# Altium schematic sheet Main_ascii.SchDoc
size 513 x 386 mm
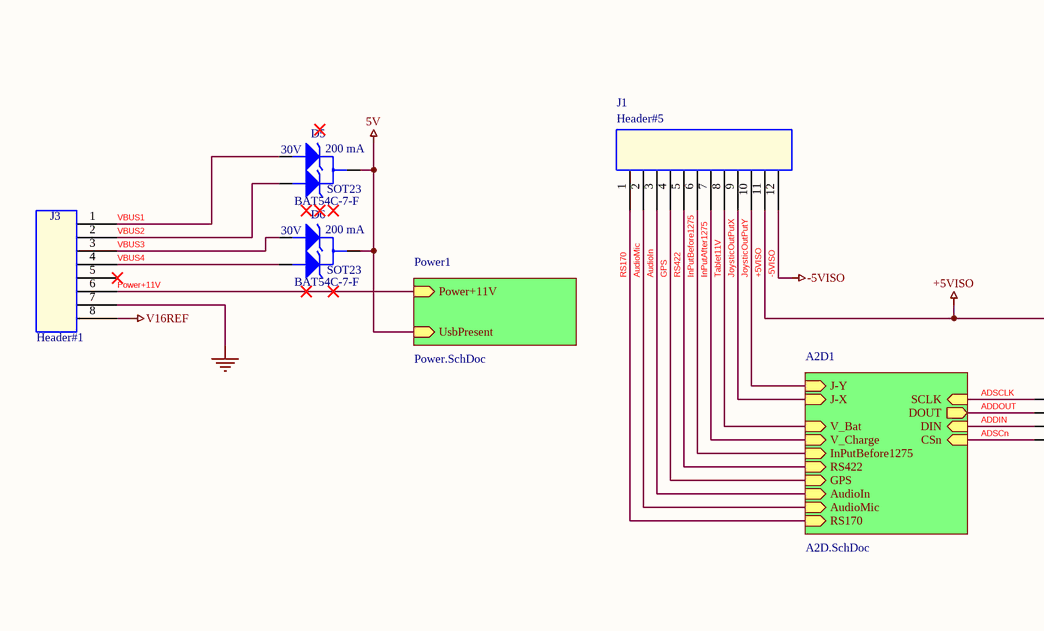
[diagram p0: Main_ascii.SchDoc, left]
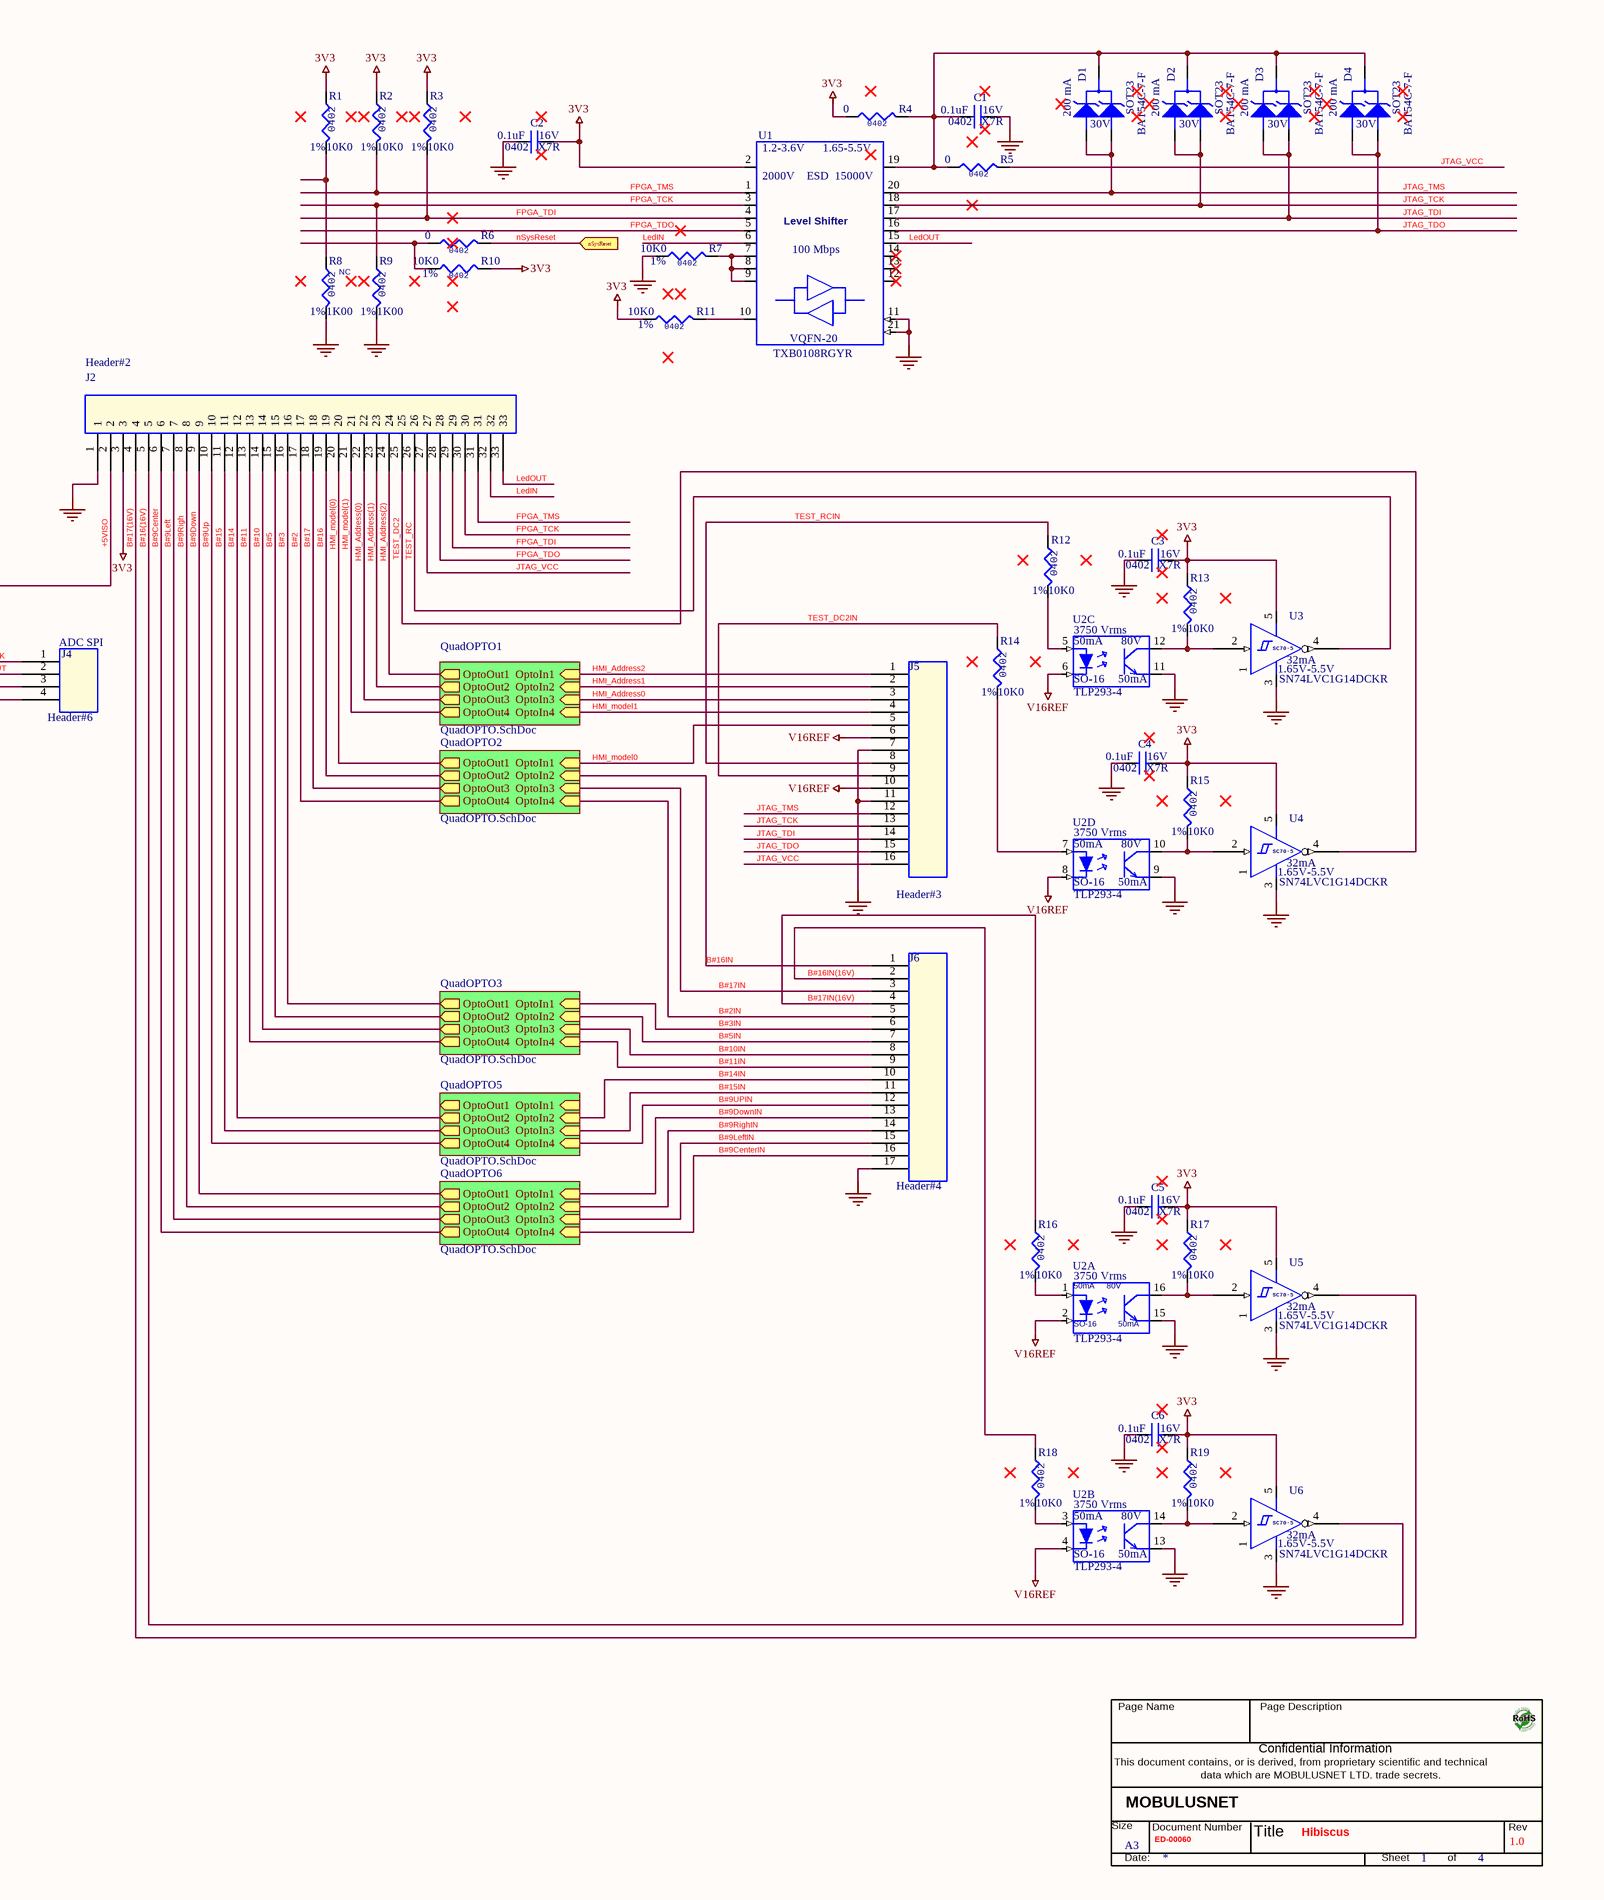
[diagram p1: Main_ascii.SchDoc, right]

## Parts
*  Title: Hibiscus  RevCode: 1.0  Page Size: A3  Page Number: 1  Page Count: 4  Doc: ED-00060  (hidden comment: MobulusTitleBlock)  (graphical)
C1  0.1uF  VOLTAGE: 16V  PCBFootPrint: 0402   X7R  [0402]
C2  0.1uF  VOLTAGE: 16V  PCBFootPrint: 0402   X7R  [0402]
C3  0.1uF  VOLTAGE: 16V  PCBFootPrint: 0402   X7R  [0402]
C4  0.1uF  VOLTAGE: 16V  PCBFootPrint: 0402   X7R  [0402]
C5  0.1uF  VOLTAGE: 16V  PCBFootPrint: 0402   X7R  [0402]
C6  0.1uF  VOLTAGE: 16V  PCBFootPrint: 0402   X7R  [0402]
D1  BAT54C-7-F  Current: 200 mA  VOLTAGE: 30V  FootPrint: SOT23  [SOT23_BAT54]
D2  BAT54C-7-F  Current: 200 mA  VOLTAGE: 30V  FootPrint: SOT23  [SOT23_BAT54]
D3  BAT54C-7-F  Current: 200 mA  VOLTAGE: 30V  FootPrint: SOT23  [SOT23_BAT54]
D4  BAT54C-7-F  Current: 200 mA  VOLTAGE: 30V  FootPrint: SOT23  [SOT23_BAT54]
D5  BAT54C-7-F  Current: 200 mA  VOLTAGE: 30V  FootPrint: SOT23  [SOT23_BAT54]
D6  BAT54C-7-F  Current: 200 mA  VOLTAGE: 30V  FootPrint: SOT23  [SOT23_BAT54]
J1  Header#5  [39-28-1123]
J2  Header#2  [501190-3027]
J3  Header#1  [B07B-XASK-1]
J4  Header#6  Label: ADC SPI  [B04B-XASK-1]
J5  Header#3  [501568-1507]
J6  Header#4  [501568-1507]
R1  10K0  Tolerance: 1%  [0402]
R2  10K0  Tolerance: 1%  [0402]
R3  10K0  Tolerance: 1%  [0402]
R4  0  [0402]
R5  0  [0402]
R6  0  [0402]
R7  10K0  Tolerance: 1%  [0402]
R8  1K00  Tolerance: 1%  ASSY: NC  [0402]
R9  1K00  Tolerance: 1%  [0402]
R10  10K0  Tolerance: 1%  [0402]
R11  10K0  Tolerance: 1%  [0402]
R12  10K0  Tolerance: 1%  [0402]
R13  10K0  Tolerance: 1%  [0402]
R14  10K0  Tolerance: 1%  [0402]
R15  10K0  Tolerance: 1%  [0402]
R16  10K0  Tolerance: 1%  [0402]
R17  10K0  Tolerance: 1%  [0402]
R18  10K0  Tolerance: 1%  [0402]
R19  10K0  Tolerance: 1%  [0402]
U1  TXB0108RGYR  Data rate: 100 Mbps  Voltage: 1.2-3.6V      1.65-5.5V  PcbFootprint: VQFN-20  ESD: 2000V    ESD  15000V  [VQFN-20_TXB0108]
U2  TLP293-4  Power: 50mA      80V  ISO: 3750 Vrms  FootPrint: SO-16  Current Power: 50mA  [SO-16_TLP293-4]  (parts A,B,C,D of 4)
U3  SN74LVC1G14DCKR  VOLTAGE: 1.65V-5.5V  Current: 32mA  [SC70-5_SN74LVC1G14DCKR]
U4  SN74LVC1G14DCKR  VOLTAGE: 1.65V-5.5V  Current: 32mA  [SC70-5_SN74LVC1G14DCKR]
U5  SN74LVC1G14DCKR  VOLTAGE: 1.65V-5.5V  Current: 32mA  [SC70-5_SN74LVC1G14DCKR]
U6  SN74LVC1G14DCKR  VOLTAGE: 1.65V-5.5V  Current: 32mA  [SC70-5_SN74LVC1G14DCKR]

## Sub-sheets
A2D1 = A2D.SchDoc: V_Charge (in), V_Bat (in), J-X (in), J-Y (in), DIN (in), SCLK (in), CSn (in), DOUT (out), RS170 (in), InPutBefore1275 (in), AudioIn (in), AudioMic (in), GPS (in), RS422 (in)
Power1 = Power.SchDoc: UsbPresent (in), Power+11V (in)
QuadOPTO1 = QuadOPTO.SchDoc: OptoIn4 (in), OptoOut4 (out), OptoOut3 (out), OptoIn2 (in), OptoOut2 (out), OptoIn3 (in), OptoOut1 (out), OptoIn1 (in)  | C4_PartReference: C8; C6_PartReference: C10; C5_PartReference: C9; U2_2_PartReference: U7; R8_PartReference: R23; R12_PartReference: R27; R10_PartReference: R25; U2_PartReference: U7; R__PartReference: R20; R__1_PartReference: R22; R__2_PartReference: R24; U2_3_PartReference: U7; R__3_PartReference: R26; U2_1_PartReference: U7; R6_PartReference: R21; C3_PartReference: C7; TitleBlock_Page_Number: 2; TitleBlock_Schematic_Page_Number: 1; TitleBlock_Schematic_Page_Count: 5
QuadOPTO2 = QuadOPTO.SchDoc: OptoIn4 (in), OptoOut4 (out), OptoOut3 (out), OptoIn2 (in), OptoOut2 (out), OptoIn3 (in), OptoOut1 (out), OptoIn1 (in)  | C4_PartReference: C12; C6_PartReference: C14; C5_PartReference: C13; U2_2_PartReference: U8; R8_PartReference: R31; R12_PartReference: R35; R10_PartReference: R33; U2_PartReference: U8; R__PartReference: R28; R__1_PartReference: R30; R__2_PartReference: R32; U2_3_PartReference: U8; R__3_PartReference: R34; U2_1_PartReference: U8; R6_PartReference: R29; C3_PartReference: C11; TitleBlock_Page_Number: 3; TitleBlock_Schematic_Page_Number: 2; TitleBlock_Schematic_Page_Count: 5
QuadOPTO3 = QuadOPTO.SchDoc: OptoIn4 (in), OptoOut4 (out), OptoOut3 (out), OptoIn2 (in), OptoOut2 (out), OptoIn3 (in), OptoOut1 (out), OptoIn1 (in)  | C4_PartReference: C16; C6_PartReference: C18; C5_PartReference: C17; U2_2_PartReference: U9; R8_PartReference: R39; R12_PartReference: R43; R10_PartReference: R41; U2_PartReference: U9; R__PartReference: R36; R__1_PartReference: R38; R__2_PartReference: R40; U2_3_PartReference: U9; R__3_PartReference: R42; U2_1_PartReference: U9; R6_PartReference: R37; C3_PartReference: C15; TitleBlock_Page_Number: 4; TitleBlock_Schematic_Page_Number: 3; TitleBlock_Schematic_Page_Count: 5
QuadOPTO5 = QuadOPTO.SchDoc: OptoIn4 (in), OptoOut4 (out), OptoOut3 (out), OptoIn2 (in), OptoOut2 (out), OptoIn3 (in), OptoOut1 (out), OptoIn1 (in)  | C4_PartReference: C20; C6_PartReference: C22; C5_PartReference: C21; U2_2_PartReference: U10; R8_PartReference: R47; R12_PartReference: R51; R10_PartReference: R49; U2_PartReference: U10; R__PartReference: R44; R__1_PartReference: R46; R__2_PartReference: R48; U2_3_PartReference: U10; R__3_PartReference: R50; U2_1_PartReference: U10; R6_PartReference: R45; C3_PartReference: C19; TitleBlock_Page_Number: 5; TitleBlock_Schematic_Page_Number: 4; TitleBlock_Schematic_Page_Count: 5
QuadOPTO6 = QuadOPTO.SchDoc: OptoIn4 (in), OptoOut4 (out), OptoOut3 (out), OptoIn2 (in), OptoOut2 (out), OptoIn3 (in), OptoOut1 (out), OptoIn1 (in)  | C4_PartReference: C24; C6_PartReference: C26; C5_PartReference: C25; U2_2_PartReference: U11; R8_PartReference: R55; R12_PartReference: R59; R10_PartReference: R57; U2_PartReference: U11; R__PartReference: R52; R__1_PartReference: R54; R__2_PartReference: R56; U2_3_PartReference: U11; R__3_PartReference: R58; U2_1_PartReference: U11; R6_PartReference: R53; C3_PartReference: C23; TitleBlock_Page_Number: 6; TitleBlock_Schematic_Page_Number: 5; TitleBlock_Schematic_Page_Count: 5

## Ports
nSysReset (in)

## Nets
3V3: C2.2 C3.2 C4.2 C5.2 C6.2 J2.3 R1.1 R2.1 R3.1 R4.1 R10.2 R11.1 R13.1 R15.1 R17.1 R19.1 U1.2(VCCA) U3.5(VCC) U4.5(VCC) U5.5(VCC) U6.5(VCC)
5V: D5.3(CATHODE) D6.3(CATHODE) ; sheet Power1/UsbPresent
+5VISO: J1.11 J2.2
-5VISO: J1.12
GND: C1.2 C2.1 C3.1 C4.1 C5.1 C6.1 J2.1 J3.7 J5.7 J5.11 J6.17 R7.1 R8.2 R9.2 U1.11(GND) U1.21(EP) U2.9(E) U2.11(E) U2.13(E) U2.15(E) U3.3(GND) U4.3(GND) U5.3(GND) U6.3(GND)
V16REF: J3.8 J5.6 J5.10 U2.2(K) U2.4(K) U2.6(K) U2.8(K)
ADDIN: J4.3 ; sheet A2D1/DIN
ADDOUT: J4.2 ; sheet A2D1/DOUT
ADSCLK: J4.1 ; sheet A2D1/SCLK
ADSCn: J4.4 ; sheet A2D1/CSn
AudioIn: J1.3 ; sheet A2D1/AudioIn
AudioMic: J1.2 ; sheet A2D1/AudioMic
B#2: J2.17 ; sheet QuadOPTO2/OptoOut4
B#2IN: J6.5 ; sheet QuadOPTO2/OptoIn4
B#3: J2.16 ; sheet QuadOPTO3/OptoOut1
B#3IN: J6.6 ; sheet QuadOPTO3/OptoIn1
B#5: J2.15 ; sheet QuadOPTO3/OptoOut2
B#5IN: J6.7 ; sheet QuadOPTO3/OptoIn2
B#9Center: J2.6 ; sheet QuadOPTO6/OptoOut4
B#9CenterIN: J6.16 ; sheet QuadOPTO6/OptoIn4
B#9Down: J2.9 ; sheet QuadOPTO6/OptoOut1
B#9DownIN: J6.13 ; sheet QuadOPTO6/OptoIn1
B#9Left: J2.7 ; sheet QuadOPTO6/OptoOut3
B#9LeftIN: J6.15 ; sheet QuadOPTO6/OptoIn3
B#9Righ: J2.8 ; sheet QuadOPTO6/OptoOut2
B#9RighIN: J6.14 ; sheet QuadOPTO6/OptoIn2
B#9Up: J2.10 ; sheet QuadOPTO5/OptoOut4
B#9UPIN: J6.12 ; sheet QuadOPTO5/OptoIn4
B#10: J2.14 ; sheet QuadOPTO3/OptoOut3
B#10IN: J6.8 ; sheet QuadOPTO3/OptoIn3
B#11: J2.13 ; sheet QuadOPTO3/OptoOut4
B#11IN: J6.9 ; sheet QuadOPTO3/OptoIn4
B#14: J2.12 ; sheet QuadOPTO5/OptoOut2
B#14IN: J6.10 ; sheet QuadOPTO5/OptoIn2
B#15: J2.11 ; sheet QuadOPTO5/OptoOut3
B#15IN: J6.11 ; sheet QuadOPTO5/OptoIn3
B#16: J2.19 ; sheet QuadOPTO2/OptoOut2
B#16(16V): J2.5 U6.4(O)
B#16IN: J6.1 ; sheet QuadOPTO2/OptoIn2
B#16IN(16V): J6.2 R18.1
B#17: J2.18 ; sheet QuadOPTO2/OptoOut3
B#17(16V): J2.4 U5.4(O)
B#17IN: J6.3 ; sheet QuadOPTO2/OptoIn3
B#17IN(16V): J6.4 R16.1
FPGA_TCK: J2.30 R9.1 U1.3(A2)
FPGA_TDI: J2.29 R3.2 U1.4(A3)
FPGA_TDO: J2.28 U1.5(A4)
FPGA_TMS: J2.31 R2.2 U1.1(A1)
GPS: J1.4 ; sheet A2D1/GPS
HMI_Address0: J5.3 ; sheet QuadOPTO1/OptoIn3
HMI_Address1: J5.2 ; sheet QuadOPTO1/OptoIn2
HMI_Address2: J5.1 ; sheet QuadOPTO1/OptoIn1
HMI_Address(0): J2.22 ; sheet QuadOPTO1/OptoOut3
HMI_Address(1): J2.23 ; sheet QuadOPTO1/OptoOut2
HMI_Address(2): J2.24 ; sheet QuadOPTO1/OptoOut1
HMI_model0: J5.5 ; sheet QuadOPTO2/OptoIn1
HMI_model1: J5.4 ; sheet QuadOPTO1/OptoIn4
HMI_model(0): J2.20 ; sheet QuadOPTO2/OptoOut1
HMI_model(1): J2.21 ; sheet QuadOPTO1/OptoOut4
InPutAfter1275: J1.7 ; sheet A2D1/V_Charge
InPutBefore1275: J1.6 ; sheet A2D1/InPutBefore1275
JoysticOutPutX: J1.9 ; sheet A2D1/J-X
JoysticOutPutY: J1.10 ; sheet A2D1/J-Y
JTAG_TCK: D2.1(ANODE1) D2.2(ANODE2) J5.13 U1.18(B2)
JTAG_TDI: D3.1(ANODE1) D3.2(ANODE2) J5.14 U1.17(B3)
JTAG_TDO: D4.1(ANODE1) D4.2(ANODE2) J5.15 U1.16(B4)
JTAG_TMS: D1.1(ANODE1) D1.2(ANODE2) J5.12 U1.20(B1)
JTAG_VCC: J2.27 J5.16 R5.2
LedIN: J2.32 U1.6(A5)
LedOUT: J2.33 U1.15(B5)
nSysReset: R6.2 ; port nSysReset
Power+11V: J3.6 ; sheet Power1/Power+11V
RS170: J1.1 ; sheet A2D1/RS170
RS422: J1.5 ; sheet A2D1/RS422
Tablet11V: J1.8 ; sheet A2D1/V_Bat
TEST_DC2: J2.25 U4.4(O)
TEST_DC2IN: J5.9 R14.1
TEST_RC: J2.26 U3.4(O)
TEST_RCIN: J5.8 R12.1
VBUS1: D5.1(ANODE1) J3.1
VBUS2: D5.2(ANODE2) J3.2
VBUS3: D6.1(ANODE1) J3.3
VBUS4: D6.2(ANODE2) J3.4
NetC1_1: C1.1 D1.3(CATHODE) D2.3(CATHODE) D3.3(CATHODE) D4.3(CATHODE) R4.2 R5.1 U1.19(VCCB)
NetR1_2: R1.2 R8.1
NetR6_1: R6.1 R10.1
NetR7_2: R7.2 U1.7(A6) U1.8(A7) U1.9(A8)
NetR11_2: R11.2 U1.10(OE)
NetR12_2: R12.2 U2.5(A)
NetR13_2: R13.2 U2.12(C) U3.2(I)
NetR14_2: R14.2 U2.7(A)
NetR15_2: R15.2 U2.10(C) U4.2(I)
NetR16_2: R16.2 U2.1(A)
NetR17_2: R17.2 U2.16(C) U5.2(I)
NetR18_2: R18.2 U2.3(A)
NetR19_2: R19.2 U2.14(C) U6.2(I)

Not connected (* = marked no-connect by the designer): J3 5*; U1 12(B8)* 13(B7)* 14(B6)*; U3 1(NC); U4 1(NC); U5 1(NC); U6 1(NC)

## Notes on the sheet
- (in symbol MobulusTitleBlock) Page Name; Page Description; Confidential Information; This document contains, or is derived, from proprietary scientific and technical; data which are MOBULUSNET LTD. trade secrets.; MOBULUSNET; Size; Document Number; Rev; Title; Date:; Sheet; of
- (in symbol R0402_0R_5%) 0402
- (in symbol R0402_1K00_1%) 0402
- (in symbol R0402_10K0_1%) 0402
- (in symbol SN74LVC1G14DCKR) SC70-5
- (in symbol TXB0108RGYR) Level Shifter

## Library data of the parts
C1-C6 = CAP0402_0.1uF 16V: CAP_CER_0.1uF_16V_X7R_0402; Part Number: CC0402KRX7R7BB104; NO_XNET_CONNECTION: True; TYPE: X7R; OVPN: OVCC00002; MFG: Yageo; ALT_SYMBOLS_HARD: 0402_RND; ALT_SYMBOLS: 0402_RND; PCB Footprint: 0402
D1-D6 = BAT54C-7-F: DIODE ARRAY SCHOTTKY 30V SOT23-3; OVPN: OVLS00005; MFG: Diodes Incorporated; PART NUMBER: BAT54C-7-F; PCB Footprint: SOT23_BAT54
J1 = Molex 39-28-1123 4.2mm: Lumenis Part Number: CN-2005424; Power: 600V; Pitch: 4.2mm; PCB Footprint: Header#5
J2 = Molex 501190-3027 1mm_2: Lumenis Part Number: CN-2006128; Power: 50V; Foot Print: 1.00mm; Current: 1 A; PCB Footprint: 501190-3027
J3 = JST B07B-XASK-1 2_2.5mm: 2.5mm; P/N: PO11108410; PCB Footprint: Header#1
J4 = JST B04B-XASK-1 2.5mm: P/N: PO11108404; PCB Footprint: Header#6
J5 = Molex 501568-1507 1mm R/A_2: Lumenis Part Number: CN-2002538; PCB Footprint: Header#3
J6 = Molex 501568-1507 1mm R/A_1: Lumenis Part Number: CN-2002538; PCB Footprint: Header#4
R1-R3 R7 R10-R19 = R0402_10K0_1%: RES SMD 10K OHM 1% 1/16W 0402; Part Number: RC0402FR-0710KL; NO_XNET_CONNECTION: True; OVPN: OVRS00009; MFG: Yageo; Power: 1/16W; MOUNTING: SMT
R4-R6 = R0402_0R_5%: RES SMD 0 OHM JUMPER 1/16W 0402; Part Number: RC0402JR-070RL; NO_XNET_CONNECTION: True; OVPN: OVRS00001; MFG: Yageo; Current: 1A; Power: 1/16W; MOUNTING: SMT
R8 R9 = R0402_1K00_1%: RES SMD 1K OHM 1% 1/16W 0402; Part Number: RC0402FR-071KL; NO_XNET_CONNECTION: True; OVPN: OVRS00022; MFG: Yageo; Power: 1/16W; MOUNTING: SMT
U1 = TXB0108RGYR: IC ESD SUP TVS DIODES USB OTG COMPANION DEVICE; OVPN: OVIC00147; MFG: Texas Instruments; PART NUMBER: TXB0108RGYR; PCB Footprint: VQFN-20_TXB0108
U2 = TLP293-4: OPTOISOLATOR 3.75KV TRANS SO16; PART NUMBER: TLP293-4(V4,E; OVPN: OVIC00228; MFG: Toshiba Semiconductor and Storage; PCB Footprint: SO-16_TLP293-4
U3-U6 = SN74LVC1G14DCKR: IC INVERTER SCHMITT 1CH SC70-5; OVPN: OVIC00204; MFG: Texas Instruments; PART NUMBER: SN74LVC1G14DCKR; PCB Footprint: SC70-5_SN74LVC1G14DCKR
* = MobulusTitleBlock: Page Create Date: March  8, 1995; Page Modify Date: *